# EAGLE design Battery_dist (EAGLE 9.6.2)
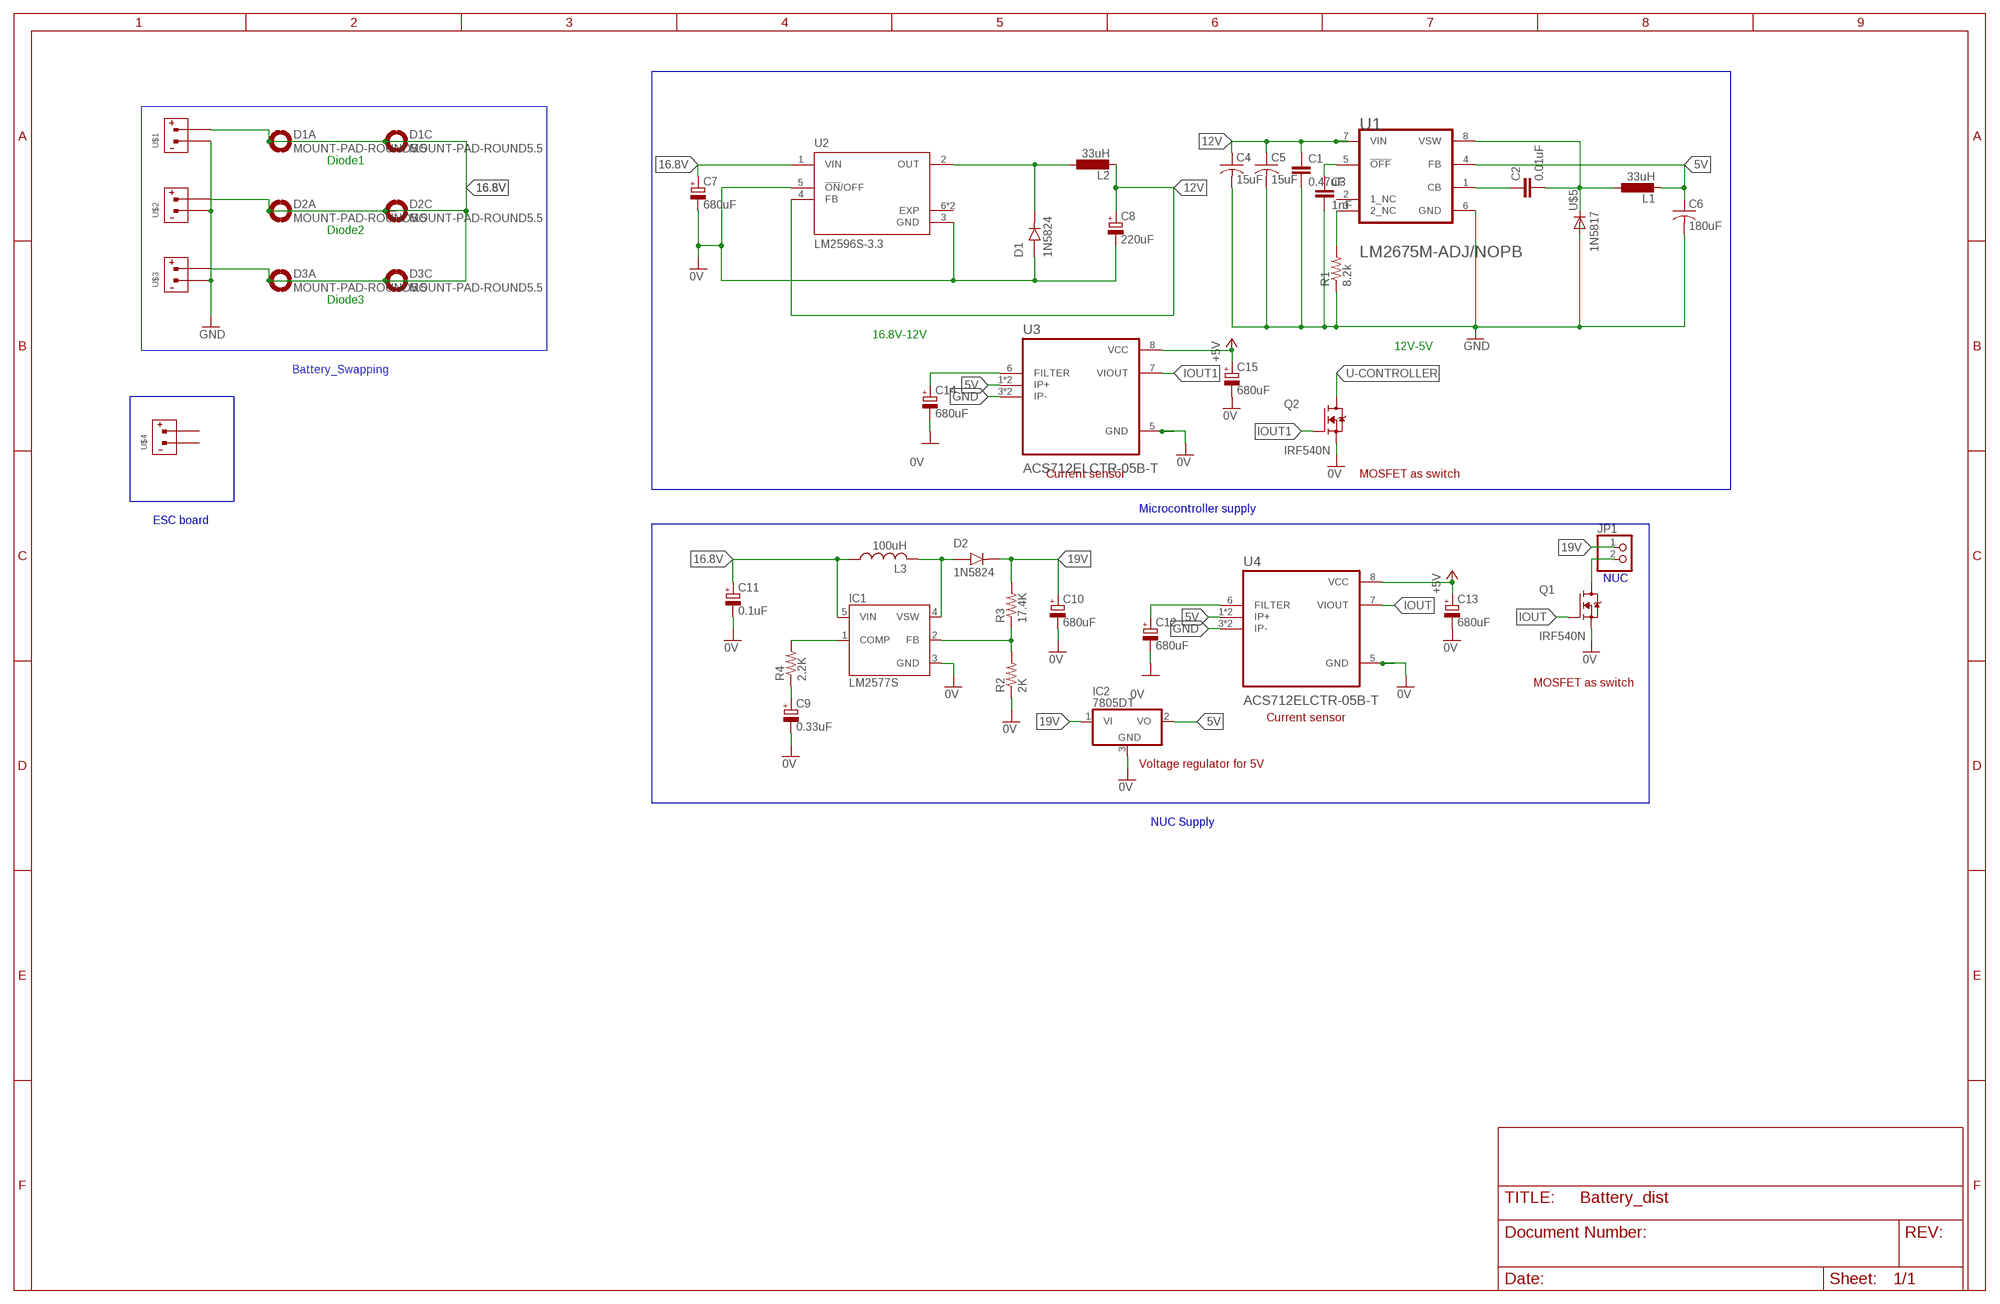
[diagram p0: schematic, sheet 1]

## Parts
C1  0.47uF  C-EU025-024X044  [C025-024X044]
C2  0.01uF  C-EU025-024X044  [C025-024X044]
C3  1nF  C-EU025-024X044  [C025-024X044]
C4  15uF  C-USC0805K  [C0805K]
C5  15uF  C-USC0805K  [C0805K]
C6  180uF  C-USC0805K  [C0805K]
C7  680uF  CPOL4.7UF  [CAP4]
C8  220uF  CPOL4.7UF  [CAP4]
C9  0.33uF  CPOL4.7UF  [CAP4]
C10  680uF  CPOL4.7UF  [CAP4]
C11  0.1uF  CPOL4.7UF  [CAP4]
C12  680uF  CPOL4.7UF  [CAP4]
C13  680uF  CPOL4.7UF  [CAP4]
C14  680uF  CPOL4.7UF  [CAP4]
C15  680uF  CPOL4.7UF  [CAP4]
D1  1N5824  [DIOAD1898W129L762D1143]
D1A  MOUNT-PAD-ROUND5.5  [5,5-PAD]
D1C  MOUNT-PAD-ROUND5.5  [5,5-PAD]
D2  1N5824  [DIOAD1898W129L762D1143]
D2A  MOUNT-PAD-ROUND5.5  [5,5-PAD]
D2C  MOUNT-PAD-ROUND5.5  [5,5-PAD]
D3A  MOUNT-PAD-ROUND5.5  [5,5-PAD]
D3C  MOUNT-PAD-ROUND5.5  [5,5-PAD]
IC1  LM2577S  [TO263-5]
IC2  7805DT  [TO252]
JP1  PINHD-1X2  [1X02]
L1  33uH  L-EUPIS2816  [PIS2816]
L2  33uH  L-EUPIS2816  [PIS2816]
L3  100uH  L-USL2825P  [L2825P]
Q1  IRF540N  [TO254P1054X469X1930-3]
Q2  IRF540N  [TO254P1054X469X1930-3]
R1  8.2k  R-US_M1206  [M1206]
R2  2K  R-US_M1206  [M1206]
R3  17.4K  R-US_M1206  [M1206]
R4  2.2K  R-US_M1206  [M1206]
U1  TI_NATIONAL_SEMICONDUCTOR_LM2675M-ADJ-NOPBTI_NATIONAL_SEMICONDUCTOR_LM2675M-ADJ-NOPB_0_0  [TI_NATIONAL_SEMICONDUCTOR_LM2675M-ADJ-NOPB_0]
U2  LM2596S-3.3  [VREG_LM2596S-3.3]
U3  ACS712ELCTR-05B-T  [SOIC127P600X175-8N]
U4  ACS712ELCTR-05B-T  [SOIC127P600X175-8N]
U$1  XT60PW-M  [XT60PW-M]
U$2  XT60PW-M  [XT60PW-M]
U$3  XT60PW-M  [XT60PW-M]
U$4  XT60PW-F  [XT60PW-F]
U$5  1N5817  [DO41-10]

## Nets
0V: C7.- C8.- C9.- C10.- C11.- C12.- C13.- C14.- C15.- D1.A IC1.3(GND) IC2.3(GND) Q1.3(S) Q2.3(S) R2.1 U2.3(GND) U2.5(!ON!/OFF) U3.5(GND) U4.5(GND)
5V: C6.1 IC2.2(VO) JP1.2 L1.2 Q1.2(D) U1.4(FB) U3.1(IP+) U3.2(IP+) U4.1(IP+) U4.2(IP+)
12V: C1.1 C4.1 C5.1 C8.+ L2.2 U1.7(VIN) U2.4(FB)
16.8V: C7.+ C11.+ D1A.B5,5(MOUNT) D1C.B5,5(MOUNT) D2A.B5,5(MOUNT) D2C.B5,5(MOUNT) D3A.B5,5(MOUNT) D3C.B5,5(MOUNT) IC1.5(VIN) L3.1 U2.1(VIN) U$1.+VE U$2.+VE U$3.+VE
19V: C10.+ D2.C(K) IC2.1(VI) JP1.1 R3.2
+5V: C13.+ C15.+ U3.8(VCC) U4.8(VCC)
GND: C1.2 C3.2 C4.2 C5.2 C6.2 R1.1 U1.6(GND) U3.3(IP-) U3.4(IP-) U4.3(IP-) U4.4(IP-) U$1.-VE U$2.-VE U$3.-VE U$5.A
IOUT: Q1.1(G) U4.7(VIOUT)
IOUT1: Q2.1(G) U3.7(VIOUT)
N$1: D1.C(K) L2.1 U2.2(OUT)
N$2: C3.1 U1.5(!OFF!)
N$3: R1.2 U1.3(2_NC)
N$4: C2.1 U1.1(CB)
N$5: C2.2 L1.1 U1.8(VSW) U$5.C
N$6: IC1.2(FB) R2.2 R3.1
N$7: C14.+ U3.6(FILTER)
N$8: D2.A IC1.4(VSW) L3.2
N$10: C9.+ R4.1
N$11: IC1.1(COMP) R4.2
N$13: C12.+ U4.6(FILTER)
U-CONTROLLER: Q2.2(D)
Unconnected: U1.2(1_NC) U$4.+VE U$4.-VE

## Buses
B$1
B$2
B$3

## Notes on the sheet
- Diode1
- Diode2
- Diode3
- 16.8V-12V
- 12V-5V
- Battery_Swapping
- Current sensor | MOSFET as switch
- Microcontroller supply
- ESC board
- NUC
- MOSFET as switch
- Current sensor
- Voltage regulator for 5V
- NUC Supply

## Power pins joined to a net without a drawn wire
EXP: U2.6(EXP) U2.7(EXP)

## Library data of the parts
C1-C3 = Tiburon:C-EU: CAPACITOR, European symbol; SPICEPREFIX: C
C4-C6 = rcl:C-US: CAPACITOR, American symbol; SPICEPREFIX: C
C7-C15 = acoustic:CPOL
D1 D2 = 1N5824:1N5824: 1N5824 Check availability <https://pricing.snapeda.com/parts/1N5824/Microchip%20Technology/view-part?ref=eda>; AVAILABILITY: In Stock; DESCRIPTION: Diode Schottky 30 V 5A Through Hole Axial; MF: Microchip Technology; MP: 1N5824; PACKAGE: Axial Microsemi; PRICE: None; PURCHASE-URL: https://pricing.snapeda.com/search/part/1N5824/?ref=eda
D1A D1C D2A D2C D3A D3C = holes:MOUNT-PAD-ROUND: MOUNTING PAD, round
IC1 = LM2577:LM2577: National Semiconductor <http://www.national.com> 3.0A Step-Up "Simple Switcher"(c) 3.0A 65V NPN switch, step-up regulator Check availability <https://pricing.snapeda.com/parts/LM2577/Texas%20Instruments/view-part?ref=eda>; AVAILABILITY: Not in stock; DESCRIPTION: Boost, Flyback, Forward Converter Switching Regulator IC Positive or Negative Adjustable 1.23V 1 Output 3A (Switch) TO-263-6, D²Pak (5 Leads + Tab), TO-263BA; MF: Texas Instruments; MP: LM2577; PACKAGE: TO-263 Texas Instruments; PRICE: None
IC2 = linear:78*: Positive VOLTAGE REGULATOR Source: http://cache.national.com/ds/LM/LM78L05.pdf http://www.fairchildsemi.com/ds/LM/LM7805.pdf
JP1 = pinhead:PINHD-1X2: PIN HEADER
L1 L2 = rcl:L-EU: INDUCTOR, European symbol; SPICEPREFIX: L
L3 = rcl:L-US: INDUCTOR, American symbol; SPICEPREFIX: L
Q1 Q2 = IRF540N:IRF540N: Check availability <https://pricing.snapeda.com/parts/IRF540N/Infineon%20Technologies/view-part?ref=eda>; AVAILABILITY: Not in stock; DESCRIPTION: Transistor NPN MOS IRF540/IRF540N INTERNATIONAL RECTIFIER Ampere=28 V=100 TO220; MF: Infineon Technologies; MP: IRF540N; PACKAGE: Package; PRICE: None
R1-R4 = rcl:R-US_: RESISTOR, American symbol; SPICEPREFIX: R
U1 = NOPB:TI_NATIONAL_SEMICONDUCTOR_LM2675M-ADJ-NOPB: PM-REG-LM2675M-12; CIIVA_IDS: 1247507; CODE__IPC: SOIC127P600-8; CODE__JEDEC: MS-012-AA; COMPONENT_LINK_1_DESCRIPTION: Datasheet URL; COMPONENT_LINK_1_URL: http://www.ti.com/general/docs/lit/getliterature.tsp?genericPartNumber=LM2675&fileType=pdf; COMP_TYPE: Switcher; FOOTPRINT_VARIANT_NAME_0: Level C; FOOTPRINT_VARIANT_NAME_1: Level B; FOOTPRINT_VARIANT_NAME_2: Level A; IMPORTED: yes; IMPORTED_FROM: vault; IMPORT_TS: 1521845858; MF: TI National Semiconductor; MPN: LM2675M-ADJ/NOPB; PACKAGE: D0008A; PACKAGE_DESCRIPTION: SOIC Narrow, 4.9 x 3.9 x 1.45mm, 8 Lead, 1.27mm Pitch; PACKAGE_TOP_MARKING: NSZXTT*2675*MADJ; PIN_COUNT: 8; POWER_WISE: N; PREFIX: U; RELEASE_DATE: 1464095349; ROHS: Yes; VAULT_GUID: 84747AFF-1FCA-4AB3-827D-EB459DE35CB1; VAULT_REVISION: D45FB8A6-EF2D-49C9-A95A-6E84B0781B5D
U2 = LM2596S-3.3:LM2596S-3.3: Conv DC-DC 4.5V to 40V Inv/Step Down Single-Out 3.3V 3A 6-Pin(5+Tab) TO-263 Tube Check availability <https://pricing.snapeda.com/parts/LM2596S-3.3/Texas%20Instruments/view-part?ref=eda>; AVAILABILITY: In Stock; DESCRIPTION: SIMPLE SWITCHER&reg; 4.5V to 40V, 3A Low Component Count Step-Down Regulator 5-DDPAK/TO-263; MF: Texas Instruments; MP: LM2596S-3.3; PACKAGE: TO-263-5 Texas Instruments; PRICE: None; PURCHASE-URL: https://pricing.snapeda.com/search/part/LM2596S-3.3/?ref=eda
U3 U4 = ACS712ELCTR-05B-T:ACS712ELCTR-05B-T: Check availability <https://pricing.snapeda.com/parts/ACS712ELCTR-05B-T/Allegro%20MicroSystems%20LLC/view-part?ref=eda>; AVAILABILITY: In Stock; DESCRIPTION: Current Sensor 5A 1 Channel Hall Effect, Open Loop Bidirectional 8-SOIC (0.154, 3.90mm Width); MF: Allegro MicroSystems LLC; MP: ACS712ELCTR-05B-T; PACKAGE: SOIC-8 Allegro MicroSystems LLC; PRICE: None; PURCHASE-URL: https://pricing.snapeda.com/search/part/ACS712ELCTR-05B-T/?ref=eda
U$1-U$4 = Tiburon:XT60PW
U$5 = 1N5817:1N5817: Check availability <https://pricing.snapeda.com/parts/1N5817-T/Diodes%20Inc./view-part?ref=eda>; AVAILABILITY: In Stock; DESCRIPTION: Diode Schottky 20 V 1A Through Hole DO-41; MF: Diodes Inc.; MP: 1N5817-T; PACKAGE: DO-41 Diodes Inc.; PRICE: None; PURCHASE-URL: https://pricing.snapeda.com/search/part/1N5817-T/?ref=eda

## Board
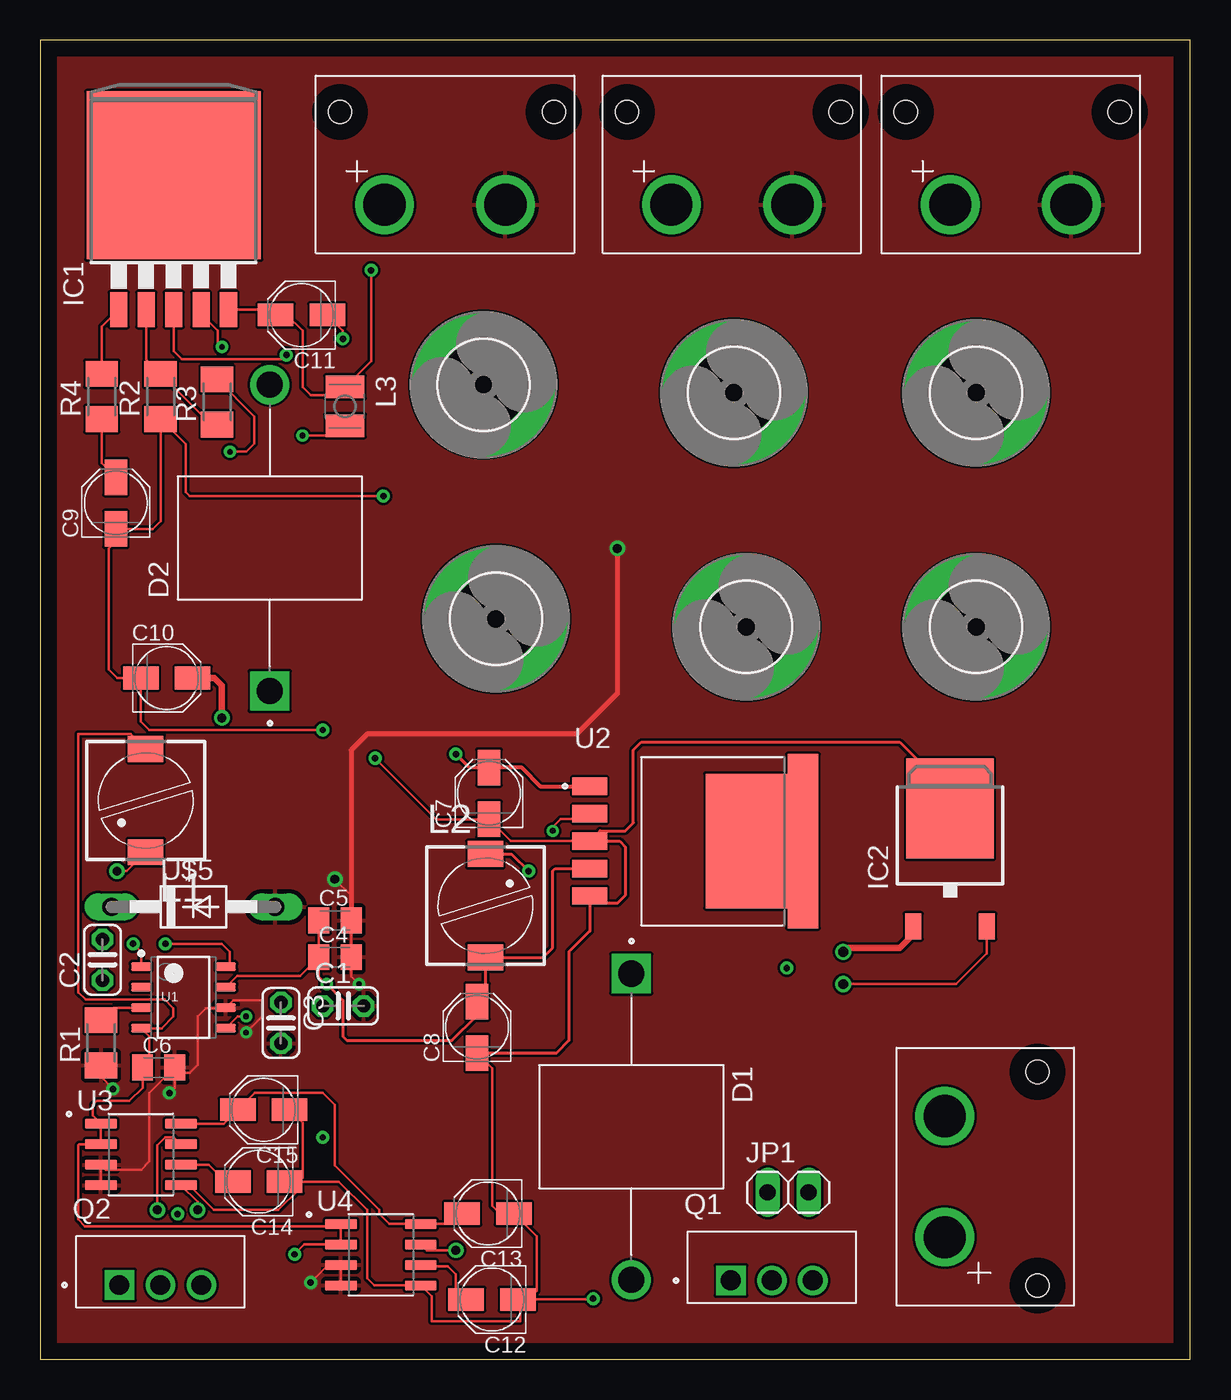
[diagram p1: board, top side]
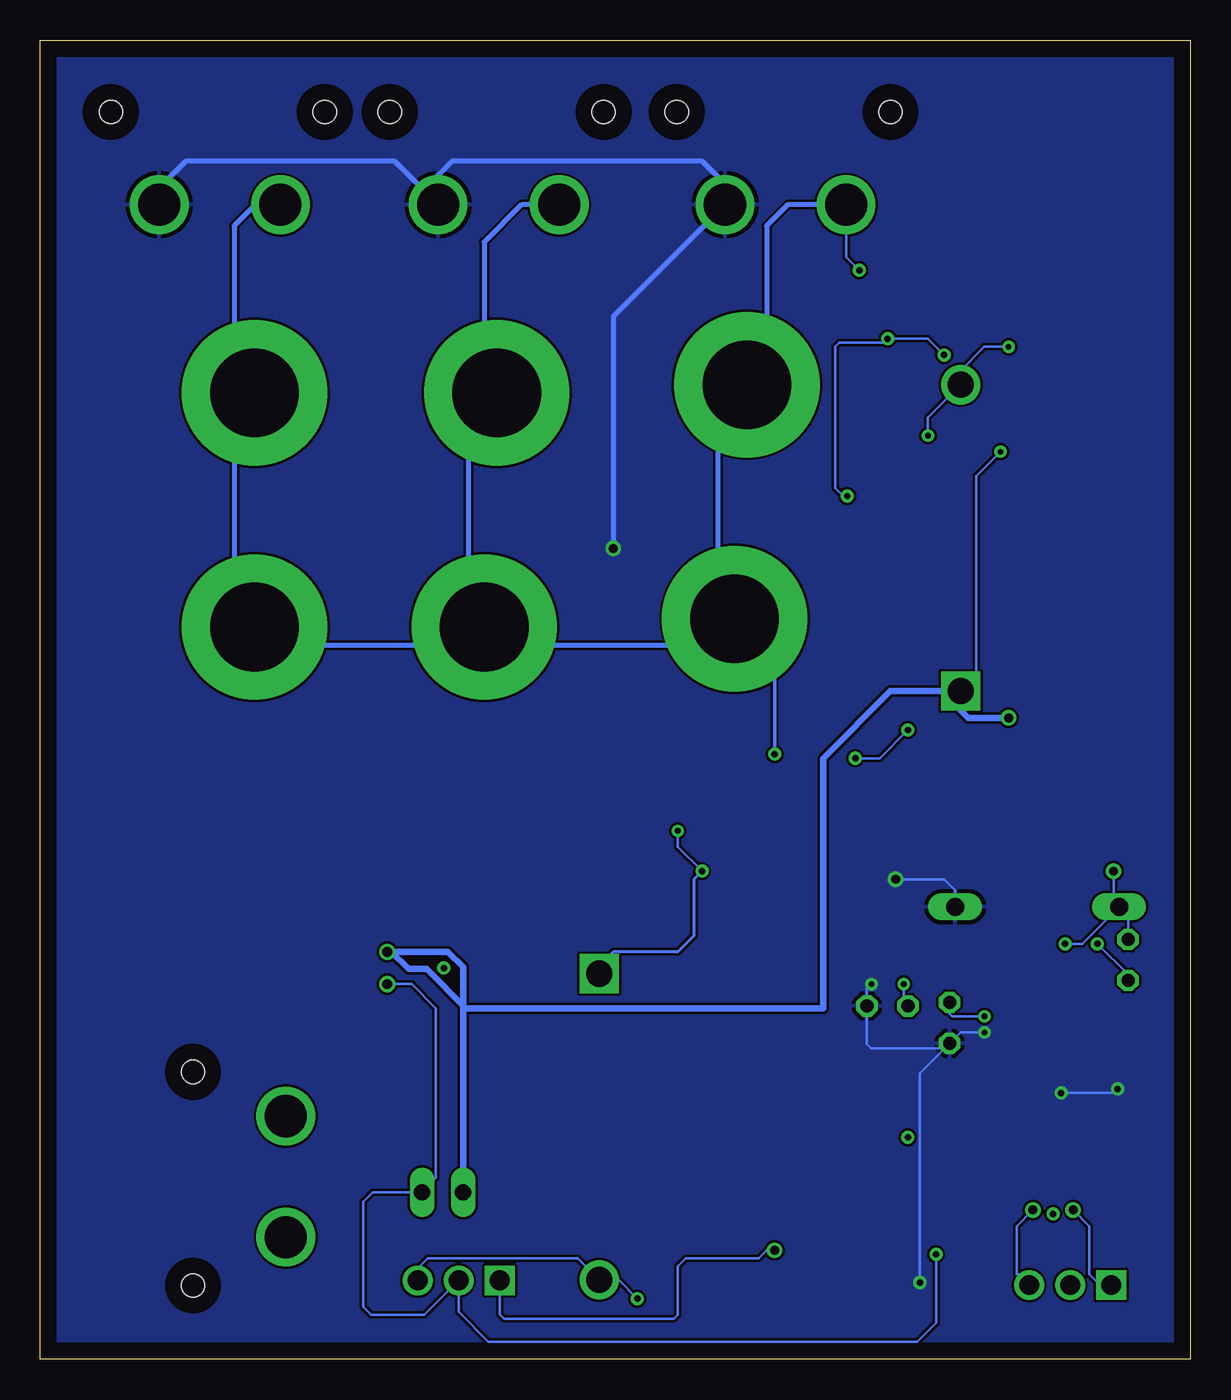
[diagram p2: board, bottom side, seen from below]

Size 71.25 x 81.75 mm. Coordinates in mm from the lower left corner, seen from the top.
Outline: 0,0 71.25,0 71.25,81.75 0,81.75 0,0
Copper layers (1*16): Top 0.035mm / dielectric 1.5mm / Bottom 0.035mm
Design rules "default": minimum track width 6mil, minimum drill 0.35mm, track to track 6mil, track to pad 6mil, pad to pad 6mil, via to via 6mil, smd to smd 6mil, copper to edge 40mil, drill to drill 6mil, minimum pad ring 10mil, minimum via ring 8mil, stop-mask expansion 4mil, vias tented up to drill 0mil, thermal gap 10mil

### Footprints (pad centres in the part's own frame; a part is rotated, then mirrored left to right if it is on the bottom)
C025-024X044 = drill 0.813 octagon: 1 -1.27,0; 2 1.27,0
C0805K = smd 1.3 x 1.6: 1 -1,0; 2 1,0
CAP4 = smd 2.2 x 1.4: + 1.6,0; - -1.6,0
DIOAD1898W129L762D1143 = drill 1.62 pad 2.43: A 9.49,0 | drill 1.62 pad 2.43 square: C -9.49,0
5,5-PAD = drill 5.5 pad 9: B5,5 0,0
TO263-5 = smd 1.067 x 2.159: 1 -3.404,-5.791; 2 -1.702,-5.791; 3 0,-5.791; 4 1.702,-5.791; 5 3.404,-5.791 | smd 10.8 x 10.41: 6 0,2.54
TO252 = smd 1 x 1.6: 1 -2.28,-4.8; 2 2.28,-4.8 | smd 5.4 x 6.2: 3 0,2.5
1X02 = drill 1.016 long: 1 -1.27,0; 2 1.27,0
PIS2816 = smd 2.2 x 1.6: 1 0,3.2; 2 0,-3.2
L2825P = smd 1.4 x 2.4: 1 -1.2,0; 2 1.2,0
TO254P1054X469X1930-3 = drill 1.23 square: 1 -2.54,-0.81 | drill 1.23: 2 0,-0.81; 3 2.54,-0.81
M1206 = smd 1.6 x 2: 1 -1.4,0; 2 1.4,0
TI_NATIONAL_SEMICONDUCTOR_LM2675M-ADJ-NOPB_0 = smd 1.25 x 0.55: 1 -2.625,1.905; 2 -2.625,0.635; 3 -2.625,-0.635; 4 -2.625,-1.905; 5 2.625,-1.905; 6 2.625,-0.635; 7 2.625,0.635; 8 2.625,1.905
VREG_LM2596S-3.3 = smd 2.16 x 1.07: 1 -6.545,3.4; 2 -6.545,1.7; 3 -6.545,0; 4 -6.545,-1.7; 5 -6.545,-3.4 | smd 5.08 x 8.33: 6 3.175,0 | smd 1.91 x 10.8: 7 6.67,0
SOIC127P600X175-8N = smd 1.97 x 0.6: 1 -2.475,1.905; 2 -2.475,0.635; 3 -2.475,-0.635; 4 -2.475,-1.905; 5 2.475,-1.905; 6 2.475,-0.635; 7 2.475,0.635; 8 2.475,1.905
XT60PW-M = drill 2.617: +VE 4.25,3; -VE 11.75,3 | hole 1.43: 1.5,8.75; 14.75,8.75
XT60PW-F = drill 2.617: +VE 11.75,3; -VE 4.25,3 | hole 1.43: 1.5,8.75; 14.75,8.75
DO41-10 = drill 1.118 long: A 5.08,0; C -5.08,0

### Placement (x,y rotation side)
C1  18.76,21.89 0 top
C2  3.85,24.75 90 top
C3  14.91,20.84 270 top
C4  18.26,24.92 0 top
C5  18.26,27.2 0 top
C6  7.33,18.08 0 top
C7  27.8,35.07 90 top
C8  27.06,20.57 90 top
C9  4.68,53.07 90 top
C10  7.83,42.22 0 top
C11  16.18,64.72 180 top
C12  27.99,3.7 180 top
C13  27.74,9.03 180 top
C14  13.53,11 180 top
C15  13.84,15.46 180 top
D1  36.62,14.41 270 top
D1A  57.98,45.39 0 top
D1C  57.98,59.9 0 top
D2  14.22,50.91 90 top
D2A  42.97,59.9 0 top
D2C  43.74,45.39 0 top
D3A  27.46,60.4 0 top
D3C  28.23,45.89 0 top
IC1  8.26,70.85 0 top
IC2  56.37,31.63 0 top
JP1  46.33,10.34 0 top
L1  6.53,34.63 180 top
L2  27.58,28.11 0 top
L3  18.88,59.06 270 top
Q1  45.33,5.69 0 top
Q2  7.44,5.41 0 top
R1  3.76,19.61 90 top
R2  7.45,59.67 90 top
R3  10.95,59.34 90 top
R4  3.8,59.67 90 top
U1  8.87,22.42 0 top
U2  40.59,32.11 0 top
U3  6.23,12.69 0 top
U4  21.1,6.47 0 top
U$1  52.13,68.56 0 top
U$2  34.85,68.56 0 top
U$3  17.07,68.56 0 top
U$4  53.04,19.31 270 top
U$5  9.49,28.04 0 top

### Tracks (layer width: path | path; a pad name or v marks a point on that pad's centre or on a via)
0V  (via drill 0.4, 0.55)
  Top 0.152: C15.- 16.25,14.65 16.25,11.25 16,11 | 16,11 C14.- 18.5,11 20.25,9.25 20.25,5 20.68,4.57 U4.5 24.25,3.89 24.25,2.34 29.75,2.34 29.75,3.54 29.65,3.65 | v9.75,9.25 9.75,9.74 U3.5 9.21,10.79 10.75,9.25 14.75,9.25 16,10.5 16,11 | 29.65,3.65 C12.- 34.2,3.7 v34.25,3.75 | C13.- 29.69,8.69 | 29.69,8.69 30.75,7.62 30.75,4.25 30.15,3.65 29.65,3.65 | U2.3 29.16,32.11 C7.- 24.53,33.47 v20.75,37.25 | C8.- 28,18.03 28,9.5 28.81,8.69 29.69,8.69 | v17.5,39 6.75,39 6.23,39.52 C10.- 4.78,42.22 4.25,42.75 4.25,50.25 4.68,50.68 C9.- 6.97,51.47 7.45,51.95 R2.1 9,56.72 9,53.75 9.25,53.5 v21.25,53.5 | IC1.3 8.26,62.49 8.75,62 15,62 v15.25,62.25 | C11.- 18.75,63.75 v18.75,63.25
  Top 0.2: C8.- 31.97,18.97 32.75,19.75 32.75,25.25 34.05,26.55 U2.5 34.51,28.25 35.75,28.25 36.25,28.75 36.25,31.75 35.89,32.11 U2.3 34.69,32.75 36.25,32.75 36.75,33.25 36.75,37.75 37.25,38.25 53.25,38.25 56.37,35.13 IC2.3
  Bottom 0.152: Q2.3 10.63,5.25 10.75,5.25 10.75,8.25 v9.75,9.25 | Q1.3 47.87,5.63 47.25,6.25 37.95,6.25 D1.A 35.42,4.92 v34.25,3.75 | v17.5,39 19.25,37.25 v20.75,37.25 | v15.25,62.25 16.25,63.25 v18.75,63.25 19,63 21.75,63 22,62.75 22,54 21.5,53.5 v21.25,53.5
5V  (via drill 0.4, 0.6)
  Top 0.152: IC2.2 58.65,25.15 56.75,23.25 v49.75,23.25 | L1.2 5.61,38.75 2.34,38.75 2.34,22.75 2.8,22.29 7.71,22.29 8.25,21.75 8.25,21.25 7.52,20.52 U1.4 6.75,20.01 6.75,18.5 C6.1 6.33,16.83 5.5,16 3.5,16 3.25,15.75 3.25,15.1 U3.1 U3.2 2.42,13.32 2.34,13.25 2.34,8.66 2.75,8.25 18.5,8.25 U4.1 U4.2 16.36,7.11 v15.75,6.5
  Bottom 0.152: JP1.2 47.66,10.34 | 47.66,10.34 50.66,10.34 51.25,9.75 51.25,3.25 50.75,2.75 47.46,2.75 Q1.2 45.33,2.92 43.5,1.09 16.91,1.09 15.75,2.25 v15.75,6.5 | v49.75,23.25 48.25,23.25 46.75,21.75 46.75,11.25 47.66,10.34
12V  (via drill 0.35)
  Top 0.152: C5.1 C4.1 | C4.1 16.09,23.75 12.19,23.75 U1.7 | C4.1 17.26,23.74 v17.75,23.25
  Top 0.2: U2.4 31.91,30.41 31.75,30.25 31.75,25.5 31.16,24.91 L2.2 27.58,22.69 C8.+ 27.06,21.31 25.5,19.75 19,19.75 18.75,20 18.75,22.25 v17.75,23.25
  Bottom 0.152: v17.75,23.25 17.75,22.15 C1.1
16.8V  (via drill 0.4)
  Top 0.152: IC1.5 14.24,65.06 C11.+ 15.28,64.72 16.25,63.75 16.25,60.25 16.75,59.75 18.37,59.75 L3.1 20.5,61.88 v20.5,67.5
  Top 0.203: C7.+ 26.58,36.67 v25.75,37.5
  Top 0.254: C7.+ 29.83,36.67 30.99,35.51 U2.1
  Bottom 0.152: U$3.+VE 21.32,68.32 v20.5,67.5
  Bottom 0.203: v25.75,37.5 25.75,45 26.64,45.89 D3C.B5,5
  Bottom 0.305: U$3.+VE 24.94,71.56 26.25,70.25 26.25,61.25 27.1,60.4 D3A.B5,5 28.6,60.4 29.25,59.75 29.25,46.91 D3C.B5,5 29.87,44.25 42.75,44.25 43.89,45.39 | U$2.+VE 41.44,71.56 43.75,69.25 43.75,60.68 D2A.B5,5 44.75,58.12 44.75,46.25 43.89,45.39 | U$1.+VE 57.94,71.56 59.25,70.25 59.25,60.75 58.4,59.9 D1C.B5,5 59.25,58.63 59.25,46.66 58.05,45.45 | 43.89,45.39 D2C.B5,5 44.88,44.25 57.75,44.25 58.05,44.55 58.05,45.45 | 58.05,45.45 D1A.B5,5
19V  (via drill 0.35, 0.55, 0.6)
  Top 0.152: R3.2 13.25,58.44 13.25,56.75 12.75,56.25 v11.75,56.25
  Top 0.406: C10.+ 10.78,42.22 11.25,41.75 v11.25,39.75 | IC2.1 54.09,26.33 53.26,25.5 50,25.5 v49.75,25.25
  Bottom 0.152: v11.75,56.25 13.25,54.75 13.25,42.39 D2.C
  Bottom 0.406: v11.25,39.75 13.75,39.75 14.25,40.25 14.22,40.28 D2.C 18.58,41.42 22.75,37.25 22.75,21.75 44.89,21.75 47.32,24.18 48.43,24.18 49.5,25.25 | JP1.1 45.06,24.31 46,25.25 49.5,25.25 | 49.5,25.25 v49.75,25.25
+5V
  Top 0.152: U3.8 11.38,14.6 C15.+ 13.28,16.5 17.5,16.5 18.25,15.75 18.25,12 21,9.25 21,9 21.62,8.38 U4.8 25.48,8.38 C13.+
EXP
  Top 0.152: U2.6 U2.7
GND  (via drill 0.35, 0.4, 0.55)
  Top 0.152: v18.25,29.75 19.25,28.75 19.25,27.75 | C5.2 C4.2 19.26,23.74 v19.75,23.25 | C6.2 8.66,17.75 9.25,17.75 9.75,18.25 9.75,21.25 10.25,21.75 11.46,21.75 U1.6 11.96,22.25 13.75,22.25 13.75,21.25 v12.75,20.25 | C6.2 6.75,16.5 6.75,12.25 6.25,11.75 4.06,11.75 U3.3 U3.4 | U4.4 U4.3 17.84,5.83 v16.75,4.75 | R1.1 3.76,17.49 v4.5,16.75 | C6.2 8.33,16.83 v8,16.5
  Top 0.305: v35.75,50.25 35.75,41.25 33.25,38.75 20.25,38.75 19.25,37.75 19.25,27.75 C5.2
  Bottom 0.152: U$5.A 14.57,29.07 15.25,29.75 v18.25,29.75 | v12.75,20.25 14.23,20.25 C3.2 | C3.2 15.23,19.25 19.75,19.25 20.03,19.53 C1.2 20.03,22.97 v19.75,23.25 | C3.2 16.75,17.73 v16.75,4.75 | v4.5,16.75 4.75,16.5 v8,16.5
  Bottom 0.305: U$1.-VE 63.88,72.62 62.25,74.25 49.29,74.25 U$2.-VE 46.6,73.4 45.75,74.25 30.25,74.25 28.82,72.82 U$3.-VE 35.75,64.63 v35.75,50.25
  pour Bottom: 0,81.75 0,0 71.25,0 71.25,81.75
  pour Top: 0,81.75 0,0 71.25,0 71.25,81.75
IOUT  (via drill 0.55)
  Top 0.152: U4.7 23.93,6.75 v25.75,6.75
  Bottom 0.152: v25.75,6.75 26.25,6.75 26.75,6.25 31.25,6.25 31.75,5.75 31.75,2.75 32,2.5 42.5,2.5 42.79,2.79 Q1.1
IOUT1  (via drill 0.55)
  Top 0.152: v7.25,9.25 7.25,13.25 7.75,13.75 8.28,13.75 U3.7
  Bottom 0.152: Q2.1 5.6,4.6 6.25,5.25 6.25,8.25 v7.25,9.25
N$1  (via drill 0.35, 0.4)
  Top 0.152: U2.2 33.73,33.5 32.25,33.5 31.75,33 v31.75,32.75
  Top 0.2: L2.1 29.19,31.31 v30.25,30.25
  Bottom 0.152: v31.75,32.75 31.75,31.75 v30.25,30.25
  Bottom 0.2: v30.25,30.25 30.75,29.75 30.75,26.25 31.75,25.25 35.75,25.25 36.62,24.38 D1.C
N$2  (via drill 0.35)
  Top 0.152: U1.5 12.23,21.25 v12.75,21.25
  Bottom 0.152: C3.1 14.91,21.41 14.75,21.25 v12.75,21.25
N$3
  Top 0.152: U1.3 4.54,21.79 R1.2
N$4  (via drill 0.4)
  Top 0.152: U1.1 6.24,25.25 v5.75,25.75
  Bottom 0.152: v5.75,25.75 3.85,23.85 C2.1
N$5  (via drill 0.4, 0.55)
  Top 0.152: L1.1 5.35,30.25 v4.75,30.25 | v7.75,25.75 11.25,25.75 11.75,25.25 11.75,24.58 U1.8
  Bottom 0.152: v4.75,30.25 4.75,28.38 U$5.C | U$5.C 3.85,27.48 C2.2 | U$5.C 6.7,25.75 v7.75,25.75
N$6
  Top 0.152: IC1.2 6.56,61.96 R2.2 10.58,57.94 R3.1
N$7
  Top 0.152: U3.6 10.45,12.05 11.5,11 C14.+
N$8  (via drill 0.35)
  Top 0.152: IC1.4 9.96,64.81 11,63.77 11,63 v11.25,62.75 | L3.2 18.27,57.25 v16.25,57.25
  Bottom 0.152: v11.25,62.75 12.75,62.75 14.22,61.28 D2.A 16.25,58.37 v16.25,57.25
N$9  (via drill 0.4)
  other vias: 46.25,24.25
N$10
  Top 0.152: R4.1 3.8,55.55 C9.+
N$11
  Top 0.152: IC1.1 3.8,64 R4.2
N$12  (via drill 0.4)
  other vias: 17.5,13.75
N$13
  Top 0.152: U4.6 23.66,5.75 25.25,5.75 25.75,5.25 25.75,4.25 26.3,3.7 C12.+
N$14  (via drill 0.4)
  other vias: 8.5,9